# EAGLE design amp_test_3 (EAGLE 7.6.0)
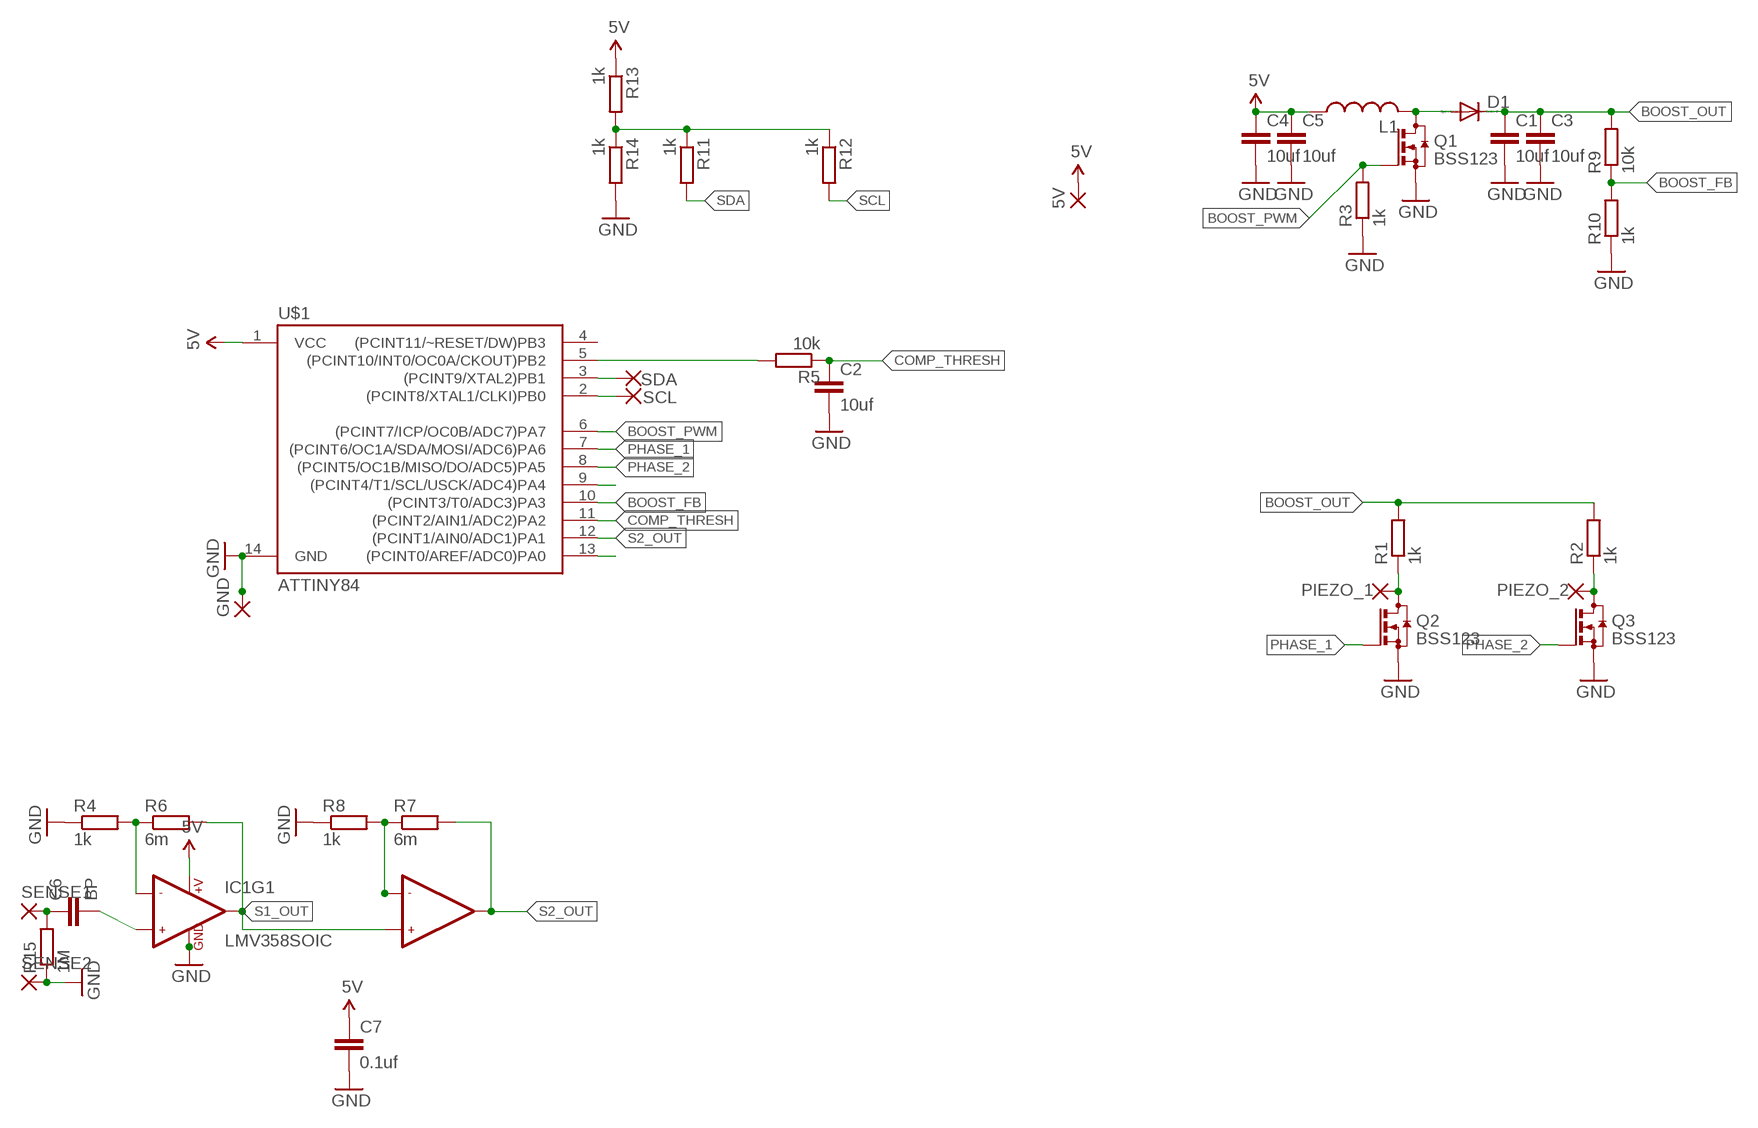
[diagram p0: schematic, sheet 1]

## Parts
5V  SMD5  [SMD2,54-5,08]
C1  10uf  C-EUC0603  [C0603]
C2  10uf  C-EUC0603  [C0603]
C3  10uf  C-EUC0603  [C0603]
C4  10uf  C-EUC0603  [C0603]
C5  10uf  C-EUC0603  [C0603]
C6  BP  C-EUC0603  [C0603]
C7  0.1uf  C-EUC0603  [C0603]
D1  CGRM4001-G  [SOD-123_MINI-SMA]
GND  SMD5  [SMD2,54-5,08]
IC1  LMV358SOIC  [SO08]
L1  L-USL2825P  [L2825P]
PIEZO_1  SMD5  [SMD2,54-5,08]
PIEZO_2  SMD5  [SMD2,54-5,08]
Q1  BSS123  [SOT23]
Q2  BSS123  [SOT23]
Q3  BSS123  [SOT23]
R1  1k  R-EU_R0603  [R0603]
R2  1k  R-EU_R0603  [R0603]
R3  1k  R-EU_R0603  [R0603]
R4  1k  R-EU_R0603  [R0603]
R5  10k  R-EU_R0603  [R0603]
R6  6m  R-EU_R0603  [R0603]
R7  6m  R-EU_R0603  [R0603]
R8  1k  R-EU_R0603  [R0603]
R9  10k  R-EU_R0603  [R0603]
R10  1k  R-EU_R0603  [R0603]
R11  1k  R-EU_R0603  [R0603]
R12  1k  R-EU_R0603  [R0603]
R13  1k  R-EU_R0603  [R0603]
R14  1k  R-EU_R0603  [R0603]
R15  1M  R-EU_R0603  [R0603]
SCL  SMD5  [SMD2,54-5,08]
SDA  SMD5  [SMD2,54-5,08]
SENSE1  SMD5  [SMD2,54-5,08]
SENSE2  SMD5  [SMD2,54-5,08]
U$1  ATTINY84  [SO14]

## Nets
5V: 5V.1(P) C4.1 C5.1 C7.1 IC1.8(+V) L1.1 R13.1 U$1.1(VCC)
BOOST_FB: R9.1 R10.2 U$1.10((PCINT3/T0/ADC3)PA3)
BOOST_OUT: C1.1 C3.1 D1.C R1.2 R2.2 R9.2
BOOST_PWM: Q1.1(G) R3.2 U$1.6((PCINT7/ICP/OC0B/ADC7)PA7)
COMP_THRESH: C2.1 R5.1 U$1.11((PCINT2/AIN1/ADC2)PA2)
GND: C1.2 C2.2 C3.2 C4.2 C5.2 C7.2 GND.1(P) IC1.4(GND) Q1.2(S) Q2.2(S) Q3.2(S) R3.1 R4.1 R8.1 R10.1 R14.2 R15.1 SENSE2.1(P) U$1.14(GND)
N$1: PIEZO_1.1(P) Q2.3(D) R1.1
N$2: PIEZO_2.1(P) Q3.3(D) R2.1
N$3: D1.A L1.2 Q1.3(D)
N$4: R5.2 U$1.5((PCINT10/INT0/OC0A/CKOUT)PB2)
N$5: C6.1 R15.2 SENSE1.1(P)
N$6: U$1.13((PCINT0/AREF/ADC0)PA0)
N$7: C6.2 IC1.3(+IN1)
N$8: R11.1 R12.1 R13.2 R14.1
N$9: IC1.2(-IN1) R4.2 R6.1
N$13: U$1.9((PCINT4/T1/SCL/USCK/ADC4)PA4)
N$15: IC1.6(-IN2) R7.1 R8.2
PHASE_1: Q2.1(G) U$1.7((PCINT6/OC1A/SDA/MOSI/ADC6)PA6)
PHASE_2: Q3.1(G) U$1.8((PCINT5/OC1B/MISO/DO/ADC5)PA5)
S1_OUT: IC1.1(OUT1) IC1.5(+IN2) R6.2
S2_OUT: IC1.7(OUT2) R7.2 U$1.12((PCINT1/AIN0/ADC1)PA1)
SCL: R12.2 SCL.1(P) U$1.2((PCINT8/XTAL1/CLKI)PB0)
SDA: R11.2 SDA.1(P) U$1.3((PCINT9/XTAL2)PB1)
Unconnected: U$1.4((PCINT11/~RESET/DW)PB3)

## Library data of the parts
5V GND PIEZO_1 PIEZO_2 SCL SDA SENSE1 SENSE2 = wirepad:SMD5: SMD PAD
C1-C7 = rcl:C-EU: CAPACITOR, European symbol
D1 = diode:CGRM400*-G: Molded plasitc,JEDEC SOD-123/Mini SMA Source: Comchip CGRM4001-G.pdf
IC1 = SparkFun-AnalogIC:LMV358: Jellybean rail-to-rail output op-amp; PROD_ID: IC-09657
L1 = rcl:L-US: INDUCTOR, American symbol
Q1-Q3 = transistor-small-signal:BSS123: N-CHANNEL MOS FET
R1-R15 = rcl:R-EU_: RESISTOR, European symbol
U$1 = SparkFun-DigitalIC:ATTINY84: Atmel 14-pin 2/4/8kB flash uC; PROD_ID: IC-11285

## Net classes
0 default: width 0.635 mm

## Board
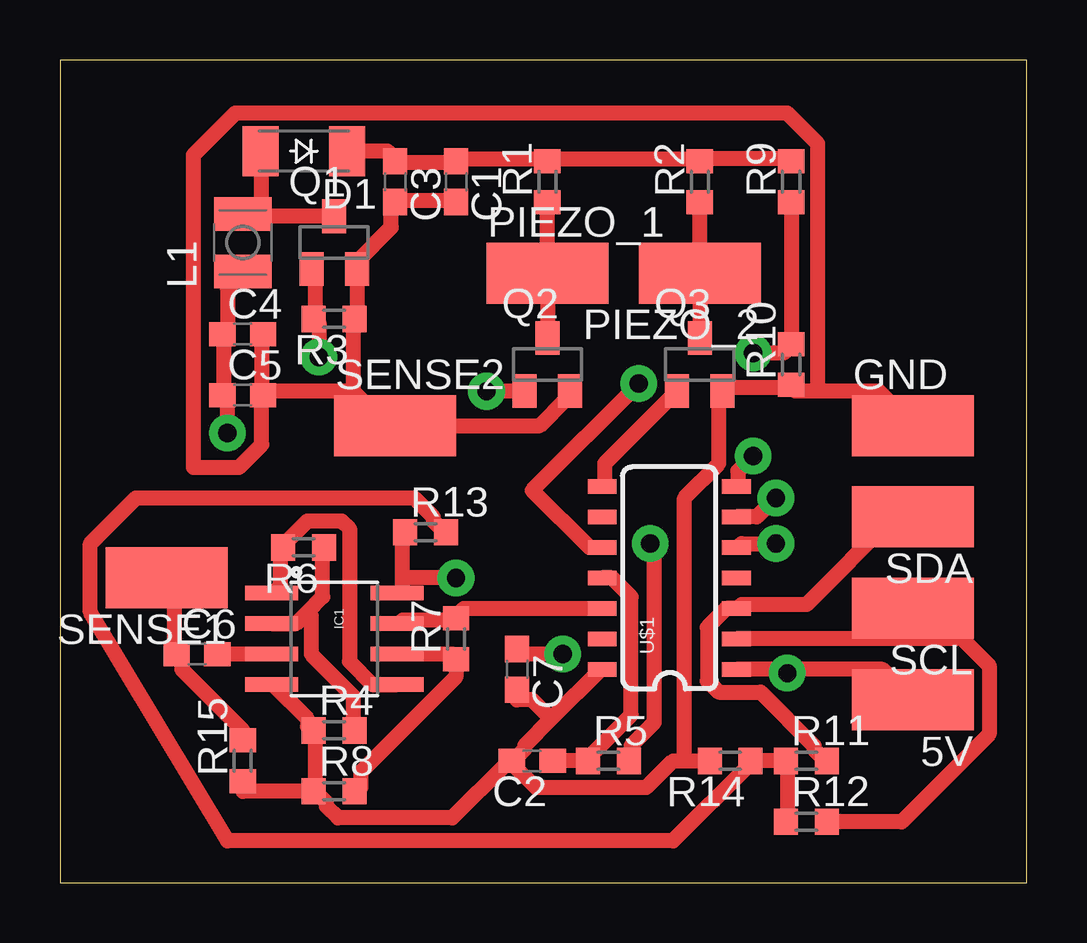
[diagram p1: board, top side]
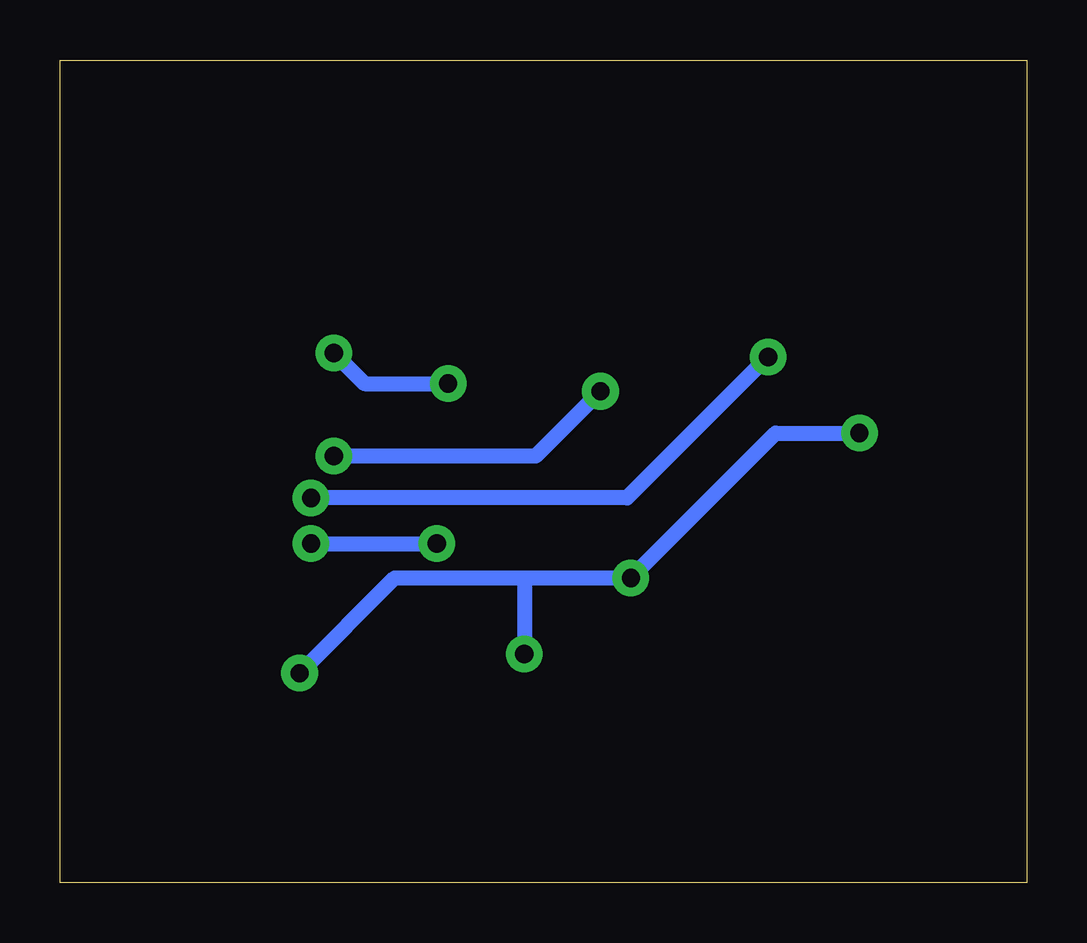
[diagram p2: board, bottom side, seen from below]

Size 40.31 x 34.28 mm. Coordinates in mm from the lower left corner, seen from the top.
Outline: 0,0 40.31,0 40.31,34.28 0,34.28 0,0
Copper layers (1*16): Top 0.035mm / dielectric 1.5mm / Bottom 0.035mm
Design rules "default *": minimum track width 10mil, minimum drill 30mil, track to track 8mil, track to pad 8mil, pad to pad 8mil, via to via 8mil, smd to smd 8mil, copper to edge 40mil, drill to drill 8mil, minimum pad ring 10mil, minimum via ring 8mil, stop-mask expansion 4mil, vias tented up to drill 0mil, thermal gap 10mil

### Footprints (pad centres in the part's own frame; a part is rotated, then mirrored left to right if it is on the bottom)
SMD2,54-5,08 = smd 2.54 x 5.08: 1 0,0
C0603 = smd 1.1 x 1: 1 -0.85,0; 2 0.85,0
SOD-123_MINI-SMA = smd 1.5 x 2.1: A 1.8,0; C -1.8,0
SO08 = smd 0.61 x 2.21: 1 -1.905,-2.616; 2 -0.635,-2.616; 3 0.635,-2.616; 4 1.905,-2.616; 5 1.905,2.616; 6 0.635,2.616; 7 -0.635,2.616; 8 -1.905,2.616
L2825P = smd 1.4 x 2.4: 1 -1.2,0; 2 1.2,0
SOT23 = smd 1 x 1.4: 1 -0.95,-1.1; 2 0.95,-1.1; 3 0,1.1
R0603 = smd 1 x 1.1: 1 -0.85,0; 2 0.85,0
SO14 = smd 0.6 x 1.2: 1 -3.81,-2.8; 2 -2.54,-2.8; 3 -1.27,-2.8; 4 0,-2.8; 5 1.27,-2.8; 6 2.54,-2.8; 7 3.81,-2.8; 8 3.81,2.8; 9 2.54,2.8; 10 1.27,2.8; 11 0,2.8; 12 -1.27,2.8; 13 -2.54,2.8; 14 -3.81,2.8

### Placement (x,y rotation side)
5V  35.56,7.62 90 top
C1  16.51,29.21 270 top
C2  19.68,5.08 180 top
C3  13.97,29.21 270 top
C4  7.62,22.86 0 top
C5  7.62,20.32 0 top
C6  5.71,9.53 0 top
C7  19.05,8.89 270 top
D1  10.16,30.48 180 top
GND  35.56,19.05 270 top
IC1  11.43,10.16 270 top
L1  7.62,26.67 90 top
PIEZO_1  20.32,25.4 270 top
PIEZO_2  26.67,25.4 90 top
Q1  11.43,26.67 0 top
Q2  20.32,21.59 0 top
Q3  26.67,21.59 0 top
R1  20.32,29.21 90 top
R2  26.67,29.21 90 top
R3  11.43,23.49 180 top
R4  11.43,6.35 0 top
R5  22.86,5.08 0 top
R6  10.16,13.97 180 top
R7  16.51,10.16 90 top
R8  11.43,3.81 0 top
R9  30.48,29.21 90 top
R10  30.48,21.59 90 top
R11  31.11,5.08 0 top
R12  31.11,2.54 0 top
R13  15.24,14.6 0 top
R14  27.94,5.08 180 top
R15  7.62,5.08 90 top
SCL  35.56,11.43 90 top
SDA  35.56,15.24 90 top
SENSE1  4.45,12.7 90 top
SENSE2  13.97,19.05 270 top
U$1  25.4,12.7 90 top

### Tracks (layer width: path | path; a pad name or v marks a point on that pad's centre or on a via)
5V  (via drill 0.76)
  Top 0.635: 14.29,12.7 14.29,12.22 14.13,12.06 IC1.8 | 14.29,12.7 14.29,14.6 R13.1 | L1.1 7.62,25.4 6.98,24.77 6.98,23.02 C4.1 6.83,22.86 6.83,20.32 C5.1 6.98,20.16 v6.98,18.73 | 30.32,8.89 34.29,8.89 5V.1 | 30.32,8.89 U$1.1 | v16.51,12.7 14.29,12.7 | v30.32,8.73 30.32,8.89 | v20.96,9.53 19.05,9.53 C7.1
  Bottom 0.635: 20.96,12.7 26.35,12.7 v30.32,8.73 | 20.96,12.7 v16.51,12.7 10.48,18.73 v6.98,18.73 | 20.96,12.7 v20.96,9.53
BOOST_FB  (via drill 0.76)
  Top 0.635: R9.1 R10.2 30.32,22.23 30.16,22.07 v28.89,22.07 | U$1.10 22.07,13.97 19.68,16.35 v24.13,20.8
  Bottom 0.635: v24.13,20.8 27.62,20.8 v28.89,22.07
BOOST_OUT
  Top 0.635: R9.2 30.48,30.16 26.67,30.16 R2.2 26.51,30.16 20.48,30.16 R1.2 20.32,30.16 16.67,30.16 C1.1 16.51,30 13.97,30 C3.1 13.81,30.32 13.65,30.48 D1.C
BOOST_PWM  (via drill 0.76)
  Top 0.635: Q1.1 10.64,25.56 10.64,23.49 R3.2 10.79,23.34 v10.79,21.91 | U$1.6 29.05,15.24 v29.85,16.03
  Bottom 0.635: v29.85,16.03 16.67,16.03 v10.79,21.91
COMP_THRESH
  Top 0.635: C2.1 R5.1 22.07,5.24 23.81,6.98 23.81,11.91 23.02,12.7 U$1.11
GND
  Top 0.635: C1.2 16.51,28.42 13.97,28.42 C3.2 13.81,28.1 13.81,27.3 12.38,25.88 Q1.2 12.38,25.56 12.38,23.49 R3.1 | C5.2 8.41,20.32 8.41,22.86 C4.2 | 12.22,23.34 R3.1 | SENSE2.1 20,19.05 21.11,20.16 21.11,20.48 Q2.2 | 14.13,19.21 SENSE2.1 | 31.59,20.48 34.13,20.48 GND.1 | 31.59,20.48 30.64,20.48 R10.1 30.48,20.64 27.62,20.64 Q3.2 27.46,20.32 27.46,17.46 26.04,16.03 26.04,5.08 | R8.1 10.64,3.81 10.64,6.35 R4.1 10.32,6.51 10.32,6.83 8.89,8.26 IC1.4 | 20.48,6.83 22.54,8.89 U$1.14 | 20.48,6.83 19.37,5.71 19.37,5.56 18.89,5.08 C2.2 | 26.04,5.08 25.56,5.08 24.45,3.97 19.84,3.97 18.89,4.92 C2.2 | 26.04,5.08 R14.2 | R8.1 10.79,3.65 11.11,3.33 11.11,3.18 11.59,2.7 16.35,2.7 18.57,4.92 C2.2 | 31.59,20.48 31.59,30.8 30.32,32.07 7.3,32.07 5.56,30.32 5.56,17.3 7.46,17.3 8.41,18.26 8.41,20.16 C5.2 | 12.22,20.48 8.73,20.48 C5.2 | 12.22,20.48 12.22,23.02 R3.1 | 12.22,20.48 13.81,18.89 SENSE2.1 | 20.48,6.83 19.68,7.62 19.05,7.62 C7.2 | R8.1 7.62,3.81 R15.1
N$1
  Top 0.635: R1.1 PIEZO_1.1 Q2.3
N$2
  Top 0.635: R2.1 PIEZO_2.1 Q3.3
N$3
  Top 0.635: Q1.3 7.62,27.78 L1.2 8.41,27.94 8.41,30.48 D1.A
N$4  (via drill 0.76)
  Top 0.635: v24.61,14.13 24.76,13.97 24.76,6.67 23.81,5.71 23.81,5.08 R5.2 | v29.85,14.13 28.42,14.13 28.26,13.97 U$1.5
  Bottom 0.635: v29.85,14.13 v24.61,14.13
N$5
  Top 0.635: SENSE1.1 4.76,12.38 4.76,9.53 C6.1 5.08,9.53 5.08,8.89 7.62,6.35 R15.2
N$7
  Top 0.635: IC1.3 C6.2
N$8
  Top 0.635: R13.2 16.03,14.6 15.56,15.08 15.56,15.24 14.76,16.03 3.18,16.03 1.27,14.13 1.27,11.27 6.98,1.75 25.56,1.75 28.73,4.92 R14.1 R11.1 30.32,4.92 30.32,2.54 R12.1
N$9
  Top 0.635: 10.32,11.27 9.84,10.79 IC1.2 | 10.32,11.27 10.95,11.91 10.95,13.97 R6.1 | R4.2 12.22,6.35 12.22,7.78 10.48,9.53 10.48,11.11 10.32,11.27
N$15
  Top 0.635: 12.38,3.81 R8.2 12.54,3.97 12.54,4.6 16.51,8.57 R7.1 16.35,9.53 IC1.6
PHASE_1  (via drill 0.76)
  Top 0.635: v28.89,17.78 28.26,17.15 28.26,16.51 U$1.7 | v17.78,20.48 Q2.1
  Bottom 0.635: v28.89,17.78 20.48,17.78 v17.78,20.48
PHASE_2
  Top 0.635: U$1.8 22.7,16.51 22.7,17.46 Q3.1
S1_OUT
  Top 0.635: IC1.1 8.89,12.06 9.21,12.38 9.21,13.97 R6.2 9.37,14.13 10.32,15.08 11.75,15.08 12.06,14.76 12.06,9.21 13.02,8.26 IC1.5
S2_OUT
  Top 0.635: IC1.7 14.13,10.79 14.29,10.95 16.51,10.95 R7.2 16.67,11.27 16.83,11.43 U$1.12
SCL
  Top 0.635: R12.2 35.08,2.54 38.73,6.19 38.73,9.05 37.47,10.32 | 37.47,10.32 36.35,11.43 SCL.1 | U$1.2 37.31,10.16 37.47,10.32
SDA
  Top 0.635: R11.2 31.91,5.08 31.43,5.56 31.43,5.71 29.21,7.94 27.46,7.94 26.99,8.41 26.99,10.64 27.78,11.43 U$1.3 28.42,11.59 31.11,11.59 34.77,15.24 SDA.1